# Altium schematic sheet TOP_LEVEL.SchDoc
size A3; SheetNumber: 1; SheetTotal: 14
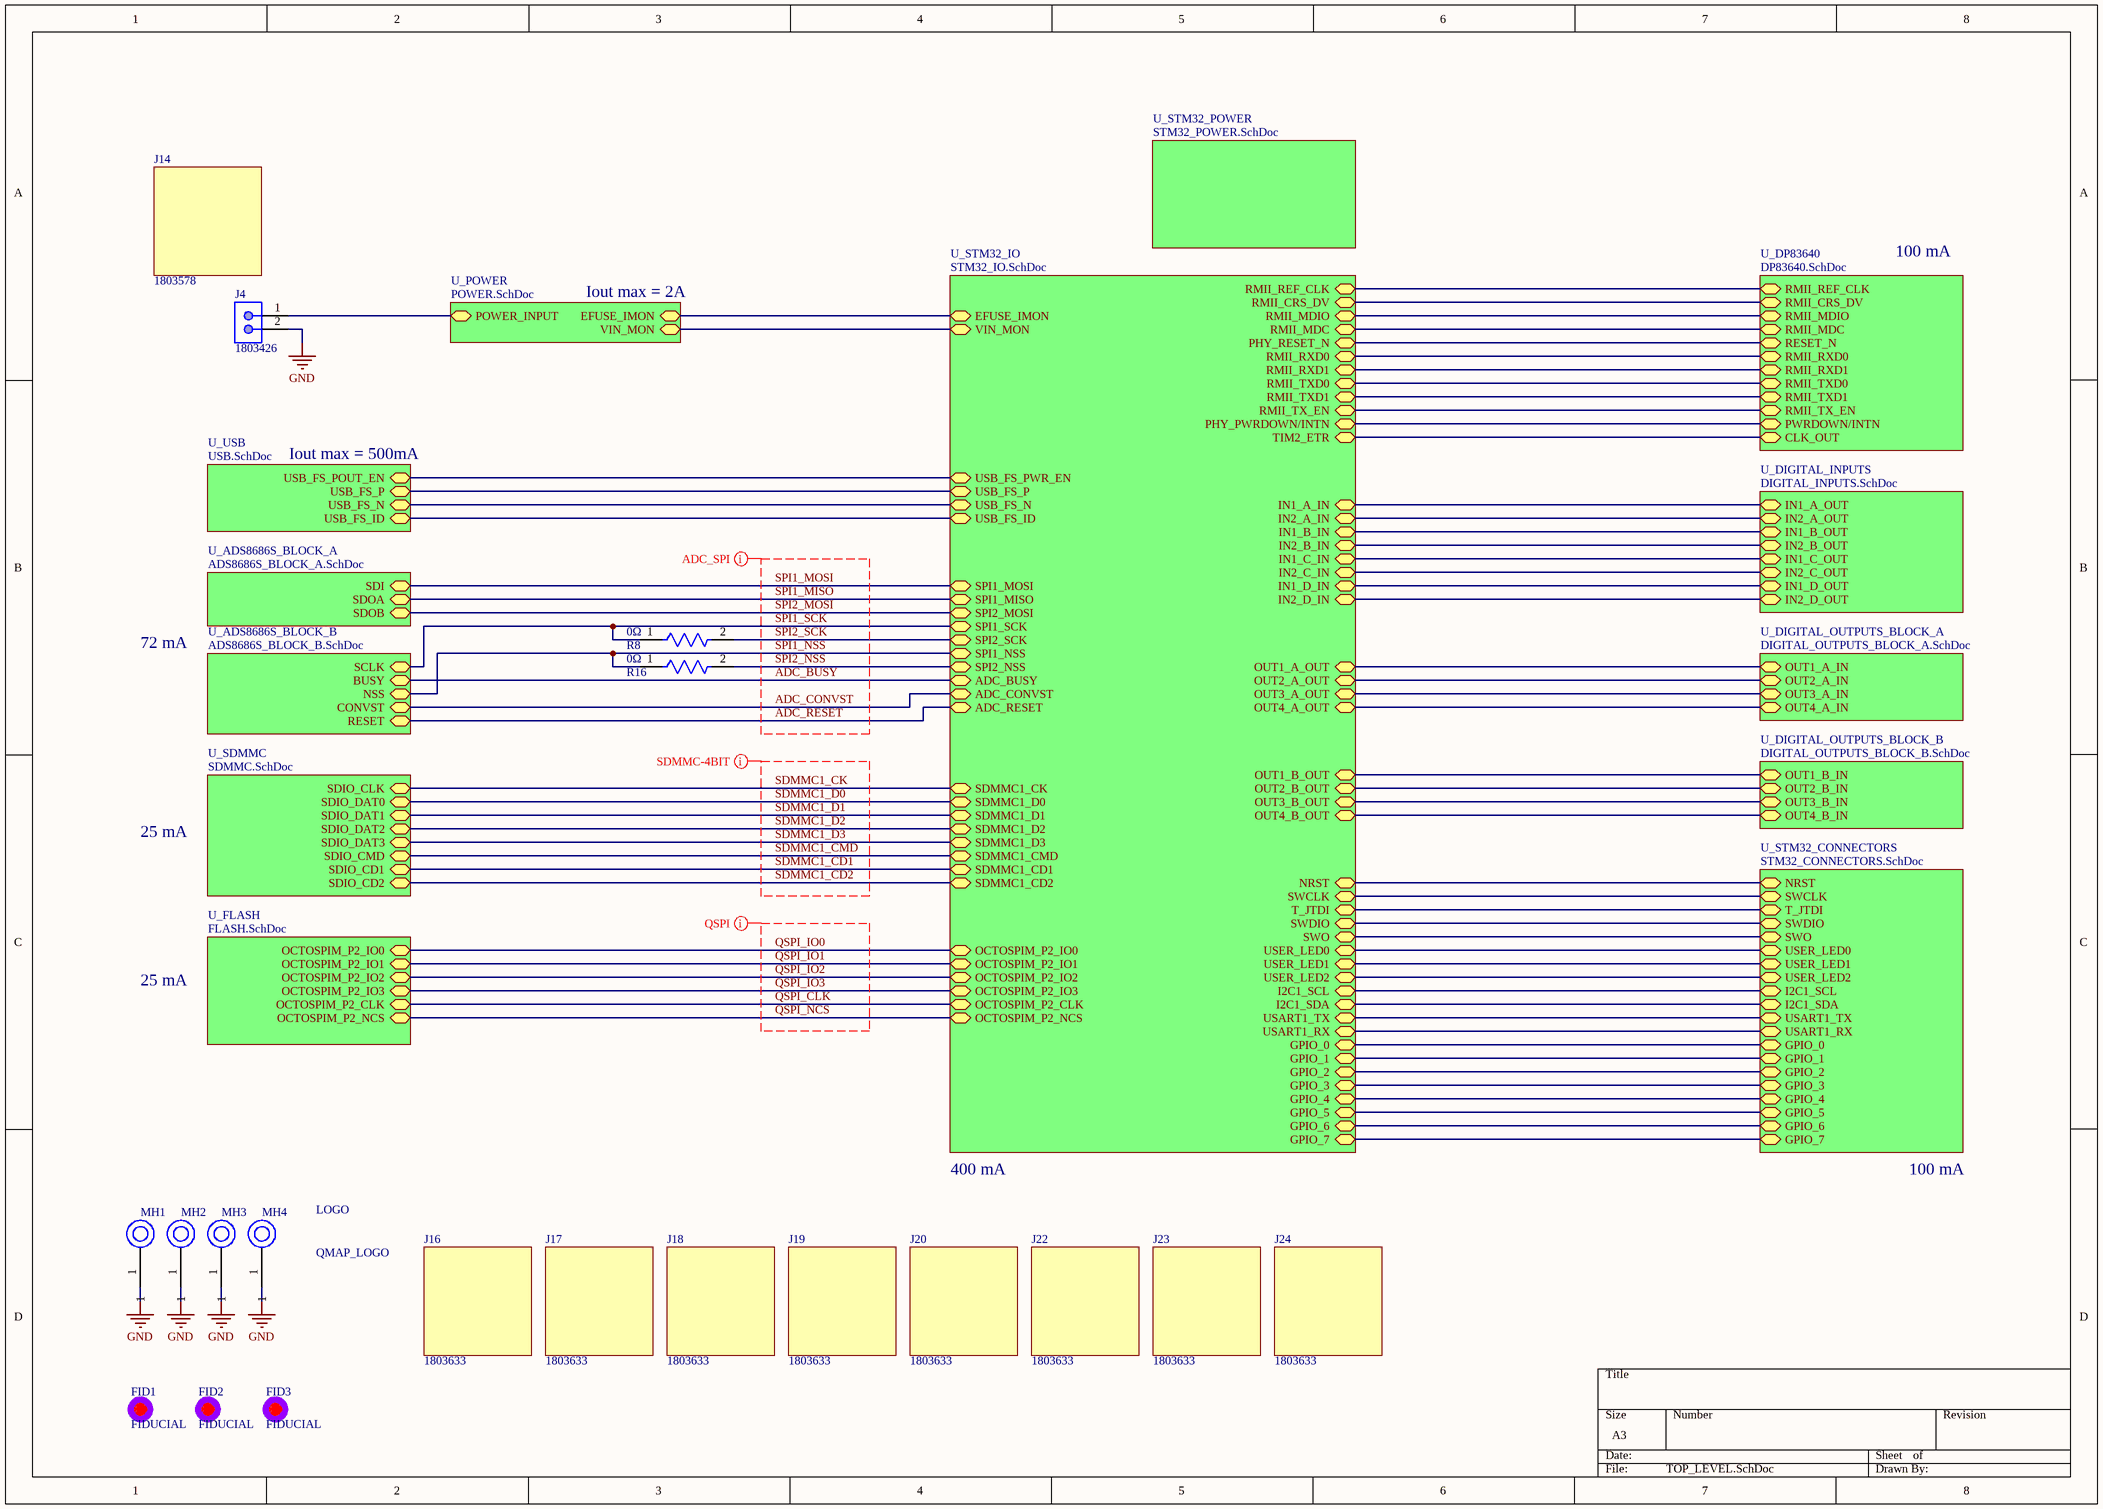
[diagram p0: TOP_LEVEL.SchDoc]

## Parts
FID1  FIDUCIAL  [FIDUCIAL]  (no BOM)
FID2  FIDUCIAL  [FIDUCIAL]  (no BOM)
FID3  FIDUCIAL  [FIDUCIAL]  (no BOM)
J4  1803426  [PHOE-1803426_V]
J14  1803578
J16  1803633
J17  1803633
J18  1803633
J19  1803633
J20  1803633
J22  1803633
J23  1803633
J24  1803633
LOGO  QMAP_LOGO  [QMAP_LOGO]  (no BOM)
MH1  MOUNTING_HOLE  [M3HOLE]  (value not drawn)  (no BOM)
MH2  MOUNTING_HOLE  [M3HOLE]  (value not drawn)  (no BOM)
MH3  MOUNTING_HOLE  [M3HOLE]  (value not drawn)  (no BOM)
MH4  MOUNTING_HOLE  [M3HOLE]  (value not drawn)  (no BOM)
R8  Resistance: 0Ω  [FP-AC0402-IPC_B]  (hidden comment: AC0402JR-070RL)
R16  Resistance: 0Ω  [FP-AC0402-IPC_B]  (hidden comment: AC0402JR-070RL)

## Sub-sheets
U_ADS8686S_BLOCK_A = ADS8686S_BLOCK_A.SchDoc: SDI (bidir), SDOB (bidir), SDOA (bidir)
U_ADS8686S_BLOCK_B = ADS8686S_BLOCK_B.SchDoc: SCLK (bidir), BUSY (bidir), NSS (bidir), CONVST (bidir), RESET (bidir)
U_DIGITAL_INPUTS = DIGITAL_INPUTS.SchDoc: IN1_A_OUT (bidir), IN2_A_OUT (bidir), IN1_B_OUT (bidir), IN2_B_OUT (bidir), IN1_C_OUT (bidir), IN2_C_OUT (bidir), IN1_D_OUT (bidir), IN2_D_OUT (bidir)
U_DIGITAL_OUTPUTS_BLOCK_A = DIGITAL_OUTPUTS_BLOCK_A.SchDoc: OUT1_A_IN (bidir), OUT2_A_IN (bidir), OUT3_A_IN (bidir), OUT4_A_IN (bidir)
U_DIGITAL_OUTPUTS_BLOCK_B = DIGITAL_OUTPUTS_BLOCK_B.SchDoc: OUT1_B_IN (bidir), OUT2_B_IN (bidir), OUT3_B_IN (bidir), OUT4_B_IN (bidir)
U_DP83640 = DP83640.SchDoc: RMII_REF_CLK (bidir), RMII_CRS_DV (bidir), RMII_MDIO (bidir), RMII_MDC (bidir), RESET_N (bidir), RMII_RXD0 (bidir), RMII_RXD1 (bidir), RMII_TXD0 (bidir), RMII_TXD1 (bidir), RMII_TX_EN (bidir), PWRDOWN/INTN (bidir), CLK_OUT (bidir)
U_FLASH = FLASH.SchDoc: OCTOSPIM_P2_IO0 (bidir), OCTOSPIM_P2_IO1 (bidir), OCTOSPIM_P2_IO2 (bidir), OCTOSPIM_P2_IO3 (bidir), OCTOSPIM_P2_CLK (bidir), OCTOSPIM_P2_NCS (bidir)
U_POWER = POWER.SchDoc: POWER_INPUT (bidir), EFUSE_IMON (bidir), VIN_MON (bidir)
U_SDMMC = SDMMC.SchDoc: SDIO_CLK (bidir), SDIO_DAT0 (bidir), SDIO_DAT1 (bidir), SDIO_DAT2 (bidir), SDIO_DAT3 (bidir), SDIO_CMD (bidir), SDIO_CD1 (bidir), SDIO_CD2 (bidir)
U_STM32_CONNECTORS = STM32_CONNECTORS.SchDoc: NRST (bidir), SWCLK (bidir), T_JTDI (bidir), SWDIO (bidir), SWO (bidir), USER_LED0 (bidir), USER_LED1 (bidir), USER_LED2 (bidir), I2C1_SCL (bidir), I2C1_SDA (bidir), USART1_TX (bidir), USART1_RX (bidir), GPIO_0 (bidir), GPIO_1 (bidir), GPIO_2 (bidir), GPIO_3 (bidir), GPIO_4 (bidir), GPIO_5 (bidir), GPIO_6 (bidir), GPIO_7 (bidir)
U_STM32_IO = STM32_IO.SchDoc: RMII_REF_CLK (bidir), RMII_CRS_DV (bidir), RMII_MDIO (bidir), RMII_MDC (bidir), RMII_RXD0 (bidir), RMII_RXD1 (bidir), RMII_TXD0 (bidir), RMII_TXD1 (bidir), RMII_TX_EN (bidir), SPI1_MISO (bidir), SPI1_SCK (bidir), SPI1_NSS (bidir), SPI2_NSS (bidir), SPI2_SCK (bidir), USB_FS_N (bidir), USB_FS_P (bidir), USB_FS_ID (bidir), USB_FS_PWR_EN (bidir), SPI2_MOSI (bidir), SPI1_MOSI (bidir), SDMMC1_D0 (bidir), SDMMC1_D1 (bidir), SDMMC1_D2 (bidir), SDMMC1_D3 (bidir), SDMMC1_CK (bidir), SDMMC1_CMD (bidir), SDMMC1_CD1 (bidir), SDMMC1_CD2 (bidir), OCTOSPIM_P2_IO0 (bidir), OCTOSPIM_P2_IO1 (bidir), OCTOSPIM_P2_IO2 (bidir), OCTOSPIM_P2_IO3 (bidir), OCTOSPIM_P2_CLK (bidir), OCTOSPIM_P2_NCS (bidir), PHY_RESET_N (bidir), PHY_PWRDOWN/INTN (bidir), TIM2_ETR (bidir), IN1_A_IN (bidir), IN2_A_IN (bidir), IN1_B_IN (bidir), IN2_B_IN (bidir), IN1_C_IN (bidir), IN2_C_IN (bidir), IN1_D_IN (bidir), IN2_D_IN (bidir), OUT1_A_OUT (bidir), OUT2_A_OUT (bidir), OUT3_A_OUT (bidir), OUT4_A_OUT (bidir), OUT3_B_OUT (bidir), OUT4_B_OUT (bidir), OUT1_B_OUT (bidir), OUT2_B_OUT (bidir), EFUSE_IMON (bidir), VIN_MON (bidir), NRST (bidir), SWCLK (bidir), T_JTDI (bidir), SWDIO (bidir), SWO (bidir), USER_LED0 (bidir), USER_LED1 (bidir), USER_LED2 (bidir), I2C1_SCL (bidir), I2C1_SDA (bidir), USART1_TX (bidir), USART1_RX (bidir), GPIO_6 (bidir), GPIO_7 (bidir), GPIO_0 (bidir), GPIO_1 (bidir), GPIO_2 (bidir), GPIO_3 (bidir), GPIO_4 (bidir), GPIO_5 (bidir), ADC_BUSY (bidir), ADC_CONVST (bidir), ADC_RESET (bidir)
U_STM32_POWER = STM32_POWER.SchDoc: no entries
U_USB = USB.SchDoc: USB_FS_N (bidir), USB_FS_P (bidir), USB_FS_ID (bidir), USB_FS_POUT_EN (bidir)

## Nets
GND: J4.2
ADC_BUSY: sheet U_STM32_IO/ADC_BUSY, sheet U_ADS8686S_BLOCK_B/BUSY
ADC_CONVST: sheet U_STM32_IO/ADC_CONVST, sheet U_ADS8686S_BLOCK_B/CONVST
ADC_RESET: sheet U_STM32_IO/ADC_RESET, sheet U_ADS8686S_BLOCK_B/RESET
QSPI_CLK: sheet U_STM32_IO/OCTOSPIM_P2_CLK, sheet U_FLASH/OCTOSPIM_P2_CLK
QSPI_IO0: sheet U_STM32_IO/OCTOSPIM_P2_IO0, sheet U_FLASH/OCTOSPIM_P2_IO0
QSPI_IO1: sheet U_STM32_IO/OCTOSPIM_P2_IO1, sheet U_FLASH/OCTOSPIM_P2_IO1
QSPI_IO2: sheet U_STM32_IO/OCTOSPIM_P2_IO2, sheet U_FLASH/OCTOSPIM_P2_IO2
QSPI_IO3: sheet U_STM32_IO/OCTOSPIM_P2_IO3, sheet U_FLASH/OCTOSPIM_P2_IO3
QSPI_NCS: sheet U_STM32_IO/OCTOSPIM_P2_NCS, sheet U_FLASH/OCTOSPIM_P2_NCS
SDMMC1_CD1: sheet U_STM32_IO/SDMMC1_CD1, sheet U_SDMMC/SDIO_CD1
SDMMC1_CD2: sheet U_STM32_IO/SDMMC1_CD2, sheet U_SDMMC/SDIO_CD2
SDMMC1_CK: sheet U_STM32_IO/SDMMC1_CK, sheet U_SDMMC/SDIO_CLK
SDMMC1_CMD: sheet U_STM32_IO/SDMMC1_CMD, sheet U_SDMMC/SDIO_CMD
SDMMC1_D0: sheet U_STM32_IO/SDMMC1_D0, sheet U_SDMMC/SDIO_DAT0
SDMMC1_D1: sheet U_STM32_IO/SDMMC1_D1, sheet U_SDMMC/SDIO_DAT1
SDMMC1_D2: sheet U_STM32_IO/SDMMC1_D2, sheet U_SDMMC/SDIO_DAT2
SDMMC1_D3: sheet U_STM32_IO/SDMMC1_D3, sheet U_SDMMC/SDIO_DAT3
SPI1_MISO: sheet U_STM32_IO/SPI1_MISO, sheet U_ADS8686S_BLOCK_A/SDOA
SPI1_MOSI: sheet U_STM32_IO/SPI1_MOSI, sheet U_ADS8686S_BLOCK_A/SDI
SPI1_NSS: R16.1 ; sheet U_STM32_IO/SPI1_NSS, sheet U_ADS8686S_BLOCK_B/NSS
SPI1_SCK: R8.1 ; sheet U_STM32_IO/SPI1_SCK, sheet U_ADS8686S_BLOCK_B/SCLK
SPI2_MOSI: sheet U_STM32_IO/SPI2_MOSI, sheet U_ADS8686S_BLOCK_A/SDOB
SPI2_NSS: R16.2 ; sheet U_STM32_IO/SPI2_NSS
SPI2_SCK: R8.2 ; sheet U_STM32_IO/SPI2_SCK
NetJ4_1: J4.1 ; sheet U_POWER/POWER_INPUT
(unnamed): sheet U_POWER/EFUSE_IMON, sheet U_STM32_IO/EFUSE_IMON
(unnamed): sheet U_POWER/VIN_MON, sheet U_STM32_IO/VIN_MON
(unnamed): sheet U_USB/USB_FS_N, sheet U_STM32_IO/USB_FS_N
(unnamed): sheet U_USB/USB_FS_P, sheet U_STM32_IO/USB_FS_P
(unnamed): sheet U_USB/USB_FS_ID, sheet U_STM32_IO/USB_FS_ID
(unnamed): sheet U_USB/USB_FS_POUT_EN, sheet U_STM32_IO/USB_FS_PWR_EN
(unnamed): sheet U_STM32_IO/RMII_REF_CLK, sheet U_DP83640/RMII_REF_CLK
(unnamed): sheet U_STM32_IO/RMII_CRS_DV, sheet U_DP83640/RMII_CRS_DV
(unnamed): sheet U_STM32_IO/RMII_MDIO, sheet U_DP83640/RMII_MDIO
(unnamed): sheet U_STM32_IO/RMII_MDC, sheet U_DP83640/RMII_MDC
(unnamed): sheet U_STM32_IO/RMII_RXD0, sheet U_DP83640/RMII_RXD0
(unnamed): sheet U_STM32_IO/RMII_RXD1, sheet U_DP83640/RMII_RXD1
(unnamed): sheet U_STM32_IO/RMII_TXD0, sheet U_DP83640/RMII_TXD0
(unnamed): sheet U_STM32_IO/RMII_TXD1, sheet U_DP83640/RMII_TXD1
(unnamed): sheet U_STM32_IO/RMII_TX_EN, sheet U_DP83640/RMII_TX_EN
(unnamed): sheet U_STM32_IO/PHY_RESET_N, sheet U_DP83640/RESET_N
(unnamed): sheet U_STM32_IO/PHY_PWRDOWN/INTN, sheet U_DP83640/PWRDOWN/INTN
(unnamed): sheet U_STM32_IO/TIM2_ETR, sheet U_DP83640/CLK_OUT
(unnamed): sheet U_STM32_IO/IN1_A_IN, sheet U_DIGITAL_INPUTS/IN1_A_OUT
(unnamed): sheet U_STM32_IO/IN2_A_IN, sheet U_DIGITAL_INPUTS/IN2_A_OUT
(unnamed): sheet U_STM32_IO/IN1_B_IN, sheet U_DIGITAL_INPUTS/IN1_B_OUT
(unnamed): sheet U_STM32_IO/IN2_B_IN, sheet U_DIGITAL_INPUTS/IN2_B_OUT
(unnamed): sheet U_STM32_IO/IN1_C_IN, sheet U_DIGITAL_INPUTS/IN1_C_OUT
(unnamed): sheet U_STM32_IO/IN2_C_IN, sheet U_DIGITAL_INPUTS/IN2_C_OUT
(unnamed): sheet U_STM32_IO/IN1_D_IN, sheet U_DIGITAL_INPUTS/IN1_D_OUT
(unnamed): sheet U_STM32_IO/IN2_D_IN, sheet U_DIGITAL_INPUTS/IN2_D_OUT
(unnamed): sheet U_STM32_IO/OUT1_A_OUT, sheet U_DIGITAL_OUTPUTS_BLOCK_A/OUT1_A_IN
(unnamed): sheet U_STM32_IO/OUT2_A_OUT, sheet U_DIGITAL_OUTPUTS_BLOCK_A/OUT2_A_IN
(unnamed): sheet U_STM32_IO/OUT3_A_OUT, sheet U_DIGITAL_OUTPUTS_BLOCK_A/OUT3_A_IN
(unnamed): sheet U_STM32_IO/OUT4_A_OUT, sheet U_DIGITAL_OUTPUTS_BLOCK_A/OUT4_A_IN
(unnamed): sheet U_STM32_IO/OUT3_B_OUT, sheet U_DIGITAL_OUTPUTS_BLOCK_B/OUT3_B_IN
(unnamed): sheet U_STM32_IO/OUT4_B_OUT, sheet U_DIGITAL_OUTPUTS_BLOCK_B/OUT4_B_IN
(unnamed): sheet U_STM32_IO/OUT1_B_OUT, sheet U_DIGITAL_OUTPUTS_BLOCK_B/OUT1_B_IN
(unnamed): sheet U_STM32_IO/OUT2_B_OUT, sheet U_DIGITAL_OUTPUTS_BLOCK_B/OUT2_B_IN
(unnamed): sheet U_STM32_IO/NRST, sheet U_STM32_CONNECTORS/NRST
(unnamed): sheet U_STM32_IO/SWCLK, sheet U_STM32_CONNECTORS/SWCLK
(unnamed): sheet U_STM32_IO/T_JTDI, sheet U_STM32_CONNECTORS/T_JTDI
(unnamed): sheet U_STM32_IO/SWDIO, sheet U_STM32_CONNECTORS/SWDIO
(unnamed): sheet U_STM32_IO/SWO, sheet U_STM32_CONNECTORS/SWO
(unnamed): sheet U_STM32_IO/USER_LED0, sheet U_STM32_CONNECTORS/USER_LED0
(unnamed): sheet U_STM32_IO/USER_LED1, sheet U_STM32_CONNECTORS/USER_LED1
(unnamed): sheet U_STM32_IO/USER_LED2, sheet U_STM32_CONNECTORS/USER_LED2
(unnamed): sheet U_STM32_IO/I2C1_SCL, sheet U_STM32_CONNECTORS/I2C1_SCL
(unnamed): sheet U_STM32_IO/I2C1_SDA, sheet U_STM32_CONNECTORS/I2C1_SDA
(unnamed): sheet U_STM32_IO/USART1_TX, sheet U_STM32_CONNECTORS/USART1_TX
(unnamed): sheet U_STM32_IO/USART1_RX, sheet U_STM32_CONNECTORS/USART1_RX
(unnamed): sheet U_STM32_IO/GPIO_6, sheet U_STM32_CONNECTORS/GPIO_6
(unnamed): sheet U_STM32_IO/GPIO_7, sheet U_STM32_CONNECTORS/GPIO_7
(unnamed): sheet U_STM32_IO/GPIO_0, sheet U_STM32_CONNECTORS/GPIO_0
(unnamed): sheet U_STM32_IO/GPIO_1, sheet U_STM32_CONNECTORS/GPIO_1
(unnamed): sheet U_STM32_IO/GPIO_2, sheet U_STM32_CONNECTORS/GPIO_2
(unnamed): sheet U_STM32_IO/GPIO_3, sheet U_STM32_CONNECTORS/GPIO_3
(unnamed): sheet U_STM32_IO/GPIO_4, sheet U_STM32_CONNECTORS/GPIO_4
(unnamed): sheet U_STM32_IO/GPIO_5, sheet U_STM32_CONNECTORS/GPIO_5

Not connected (* = marked no-connect by the designer): MH1 1; MH2 1; MH3 1; MH4 1

## Layout directives
rule Width Constraint [Pref Impedance = 50.00ohms    Min Impedance = 50.00ohms    Max Impedance = 50.00ohms]; net class ADC_SPI: ADC_BUSY, ADC_CONVST, ADC_RESET, SPI1_MISO, SPI1_MOSI, SPI1_NSS, SPI1_SCK, SPI2_MOSI, SPI2_NSS, SPI2_SCK
rule Width Constraint [Pref Impedance = 50.00ohms    Min Impedance = 50.00ohms    Max Impedance = 50.00ohms]; net class SDMMC: SDMMC1_CD1, SDMMC1_CD2, SDMMC1_CK, SDMMC1_CMD, SDMMC1_D0, SDMMC1_D1, SDMMC1_D2, SDMMC1_D3
rule Width Constraint [Pref Impedance = 50.00ohms    Min Impedance = 50.00ohms    Max Impedance = 50.00ohms]; net class QSPI: QSPI_CLK, QSPI_IO0, QSPI_IO1, QSPI_IO2, QSPI_IO3, QSPI_NCS

## Notes on the sheet
- Iout max = 2A
- 100 mA
- Iout max = 500mA
- 72 mA
- 25 mA
- 400 mA

## Library data of the parts
J4 = CMP-2000-05826-1: Male Header, Pitch 3.81 mm, 1 x 2 Position, Height 9.2 mm, Tail Length 3.4 mm; Manufacturer: Phoenix Contact; Manufacturer URL: http://www.phoenixcontact.com/; Datasheet Version: 02/2015; Mounting Technology: ThroughHole; Package Description: Male Header, Pitch 3.81 mm, 1 x 2 Position, Height 9.2 mm; Datasheet URL: https://www.phoenixcontact.com/online/portal/cn/pxc/product_detail_page/!ut/p/b1/3VfHjrNIGHyWeQDG5HAkm5zjxQIM2AQDNvnp1zNa7WFX889l5YPpA6L1qUtVdFX3d4gPEYCiFAaBJHgID_Etma9lMl67W9J8fcf4iRJ1HIRRHAIZDANpTKVtR3IFAyUOwSEE0ZNTbb2iOquuOqg8OKsEReRD0XpT8cAJtHK1h62gd5Lwwj7fSR7gfNZiWNE2tu2Xg71pvaHw3VHbDIccysUbixteZxggMWJnxWgP9KIolKko13HrKNI0OD69xjcsLwZb9oJmcNi4flh1xw9LW6-eWTQ9nREGMg82nQ7i5d6Jdk07dw7fZbrokLagaoyYggEvB4C7H5W4HERjSAam7I1pSvC1iqzSu8itk8CidtE6n3bP2nD0Pp6iRD-LQiLob5pFzwLixwIWO7iH0PcgleukhedgldkYbrFLA5WSM7ufG5_qGPkUc9vEzZQaS901mlWkPYn5tWxhabkCUfW4SsSIbpPuMIJHpQReslhERyEnqVrZBIU1V5Nilrs5X123FVtC3BVOSLHMP1b6PfXsNSgk1T-F50SEmtzqQUXqhsW5rwQ1o0BXB2gELrcQ4gCUoNAFTBX6N2LEmxJz0Hclhr8rsXf1mPOuHoPf1WPwu3oMflePSW-7Fd81PGj4i1jqc2r6kGnO3K4b7QxsE14hAduG8C7FaT2GvZ7I-s0j05SGAI1kaO9y99Mt55acg9cLDNYaWwQcdDTPAtjrfMY1OBkOcVEr9HZ8tGspIQLbIVDtpjctgzHFMG4BAZsGvQthBBH4WA-nFo17BJ08nhvnnSIvtClxxDZLZLDt43EXgXAD-FUl6xp1LReX8w3Sb-3dEFiLergsTPmiPWlKHKTnUE9MvjMWis8MoKAxhXcLRQoyR1OjaJFnuS2q9AQSlWi71_PQS1I7hwNcTAR9vGjIY_k4yIf4mrafS9Z-gp_9mn329-4; Package Reference: 1803426
J14 = 1803578: Plug, Terminal Block; 8 A; 160 V; 3.81 mm; 2; Screw; 2.5 kV; 160 V; Polyamide; Manufacturer: Phoenix Contact; Number of Positions: 2; Current Rating: 8A; Gender: Male; Voltage Rating (AC): 160V; Connector Type: Screw,Power,Rectangular; Number of Levels: 1; Voltage: 300V; Pitch: 3.81mm; Wire Gauge (Max): 30AWG; Wire Gauge (Min): 14AWG; Wire/Cable Gauge: 16AWG; Stripping Length: 7mm; Approvals: UL,CSA,VDE; Supplier: Rs; Supplier Part Number: 2204658; Manufacturer Part Number: 1803578; RoHS: Yes; Category: Terminal Blocks; Stock: 1335; Pricing: 5=2.048, 75=1.866, 250=1.702, 500=1.57, 1000=1.448 (GBP); Mounting Technology: Free Hanging,Cable; Contact Material: Tin; Contact Plating: Tin; Housing Color: Green; Housing Material: Polyamide; Color: Green; Weight: 3.456848oz; Insulation Material: Nylon; Min Operating Temperature: -40°C; Max Operating Temperature: 100°C; Package Quantity: 50; Packaging: Bulk; Termination: Screw; Orientation: Right Angle; Series: MC; Number of Poles: 2; Number of Rows: 1; Max Current Rating: 8A; Number of Contacts: 2; Voltage Rating: 160V; Number of Positions Per Level: 2; Current: 8A; Max Supply Voltage: 160V; Number of Circuits: 2; Voltage Rating (DC): 160V; Length: 8.41mm; Width: 16.1mm; Height: 11.1mm; Depth: 16.1mm; Radiation Hardening: No; Lead Free: Lead Free; RoHS Compliant: Yes; Reach SVHC Compliant: No; Flammability Rating: UL94 V-0; ComponentLink1URL: https://datasheet.ciiva.com/795/1803578-795460.pdf?src-supplier=Digikey; ComponentLink1Description: https://datasheet.ciiva.com/795/1803578-795460.pdf?src-supplier=Digikey; ComponentLink2URL: https://datasheet.ciiva.com/16046/1803578-16046760.pdf?src-supplier=Onlinecomponents.com; ComponentLink2Description: https://datasheet.ciiva.com/16046/1803578-16046760.pdf?src-supplier=Onlinecomponents.com; ComponentLink3URL: https://datasheet.ciiva.com/29224/740200-da-01-en-leiterplattenstecker-mc-1-5-2-st-3-81-29224613.pdf?src-supplier=Conrad; ComponentLink3Description: https://datasheet.ciiva.com/29224/740200-da-01-en-leiterplattenstecker-mc-1-5-2-st-3-81-29224613.pdf?src-supplier=Conrad; Supplier 1: Rs; Supplier Part Number 1: 2204658
J16-J20 J22-J24 = 1803633: Plug, Terminal Block; 8 A; 160 V; 3.81 mm; 8; Screw; 2.5 kV; 160 V; Polyamide; Manufacturer: Phoenix Contact; Gender: Male; Number of Positions: 8; Current Rating: 8A; Voltage Rating: 160V; Number of Levels: 1; Voltage: 300V; Wire Gauge (Max): 30AWG; Wire Gauge (Min): 14AWG; Wire/Cable Gauge: 28AWG; Pitch: 3.81mm; Stripping Length: 7mm; Thread Size: M2; Approvals: UL,CSA,VDE,cULus,CB,EAC; Supplier 1: Rs; Supplier Part Number 1: 2204709; Supplier: Rs; Supplier Part Number: 2204709; Manufacturer Part Number: 1803633; RoHS: Yes; Category: Terminal Blocks; Stock: 1540; Pricing: 5=7.832, 125=7.048, 375=6.266, 1000=5.474, 2000=5.09 (GBP); Mounting Technology: Free Hanging,Cable; Contact Plating: Tin; Contact Material: Tin; Color: Green; Weight: 3.456848oz; Material: Nylon; Housing Color: Green; Housing Material: Polyamide; Insulation Material: Nylon; Packaging: Bulk; Series: MC; Number of Rows: 1; Package Quantity: 50; Termination: Screw; Number of Poles: 8; Max Current Rating: 8A; Max Supply Voltage: 160V; Number of Positions Per Level: 8; Current: 8A; Number of Contacts: 8; Number of Circuits: 8; Orientation: Right Angle; Connector Type: Screw; Voltage Rating (DC): 160V; Number of Ways: 8; Length: 31.27mm; Width: 31.27mm; Height: 11.1mm; Depth: 16.1mm; Radiation Hardening: No; RoHS Compliant: Yes; Reach SVHC Compliant: No; Lead Free: Lead Free; Flammability Rating: UL94 V-0; ComponentLink1URL: https://datasheet.ciiva.com/795/1803633-795565.pdf?src-supplier=Digikey; ComponentLink1Description: https://datasheet.ciiva.com/795/1803633-795565.pdf?src-supplier=Digikey; ComponentLink2URL: https://datasheet.ciiva.com/16071/1803633-16071208.pdf?src-supplier=Onlinecomponents.com; ComponentLink2Description: https://datasheet.ciiva.com/16071/1803633-16071208.pdf?src-supplier=Onlinecomponents.com; ComponentLink3URL: https://datasheet.ciiva.com/15169/getdatasheetpartid-177866-15169646.pdf?src-supplier=Verical; ComponentLink3Description: https://datasheet.ciiva.com/15169/getdatasheetpartid-177866-15169646.pdf?src-supplier=Verical; ComponentLink4URL: https://datasheet.ciiva.com/8032/100951-8032830.pdf?src-supplier=Element14; ComponentLink4Description: https://datasheet.ciiva.com/8032/100951-8032830.pdf?src-supplier=Element14; ComponentLink5URL: https://datasheet.ciiva.com/29224/740320-da-01-en-leiterplattenstecker-mc-1-5-8-st-3-81-29224629.pdf?src-supplier=Conrad; ComponentLink5Description: https://datasheet.ciiva.com/29224/740320-da-01-en-leiterplattenstecker-mc-1-5-8-st-3-81-29224629.pdf?src-supplier=Conrad; ComponentLink6URL: https://datasheet.ciiva.com/33105/1803633-33105740.pdf?src-supplier=Today+Components; ComponentLink6Description: https://datasheet.ciiva.com/33105/1803633-33105740.pdf?src-supplier=Today+Components
R8 R16 = CMP-2002-01838-3: RES 0Ω 0.00% 0.063W 0402; Temperature Coefficient: 200ppm/°C; Voltage Rating: 50V; Max Power Dissipation: 63mW; Power Rating: 62.5mW; Tolerance: 5%; Min Operating Temperature: -55°C; RoHS Compliant: Yes; Width: 0.02inch; Height: 0.015inch; Size Code: 0402; Lead Free: Lead Free; Termination: SMD/SMT; Ratings: AEC-Q200; Package Quantity: 1; Number of Terminations: 2; Case Code (Metric): 1005; Case Code (Imperial): 0402; Resistor Type: Thick Film; Features: Moisture Resistant; Length: 0.039inch; Max Operating Temperature: 155°C; Packaging: Tape and Reel; Series: AC; Case/Package: 0402